# Altium schematic sheet Gleichrichter.SchDoc
size A4; SheetNumber: 1; SheetTotal: 1; SPICEModelCacheRRXWQSHM: <root> / <DocumentId>RRXWQSHM</DocumentId> / <CacheFrame Number="0"> / <Model Name="di_1n4001" Kind="MDL"> / <Text>*************************************************************************************************************************************** / *SRC=1N4001;DI_1N4001;Diodes;Si;  50.0V  1.00A  3.00us   Diodes, Inc. diode / .MODEL DI_1N4001 D  ( IS=76.9p RS=42.0m BV=50.0 IBV=5.00u / + CJO=39.8p  M=0.333 N=1.45 TT=4.32u )</Text> / </Model> / </CacheFrame> / </root>
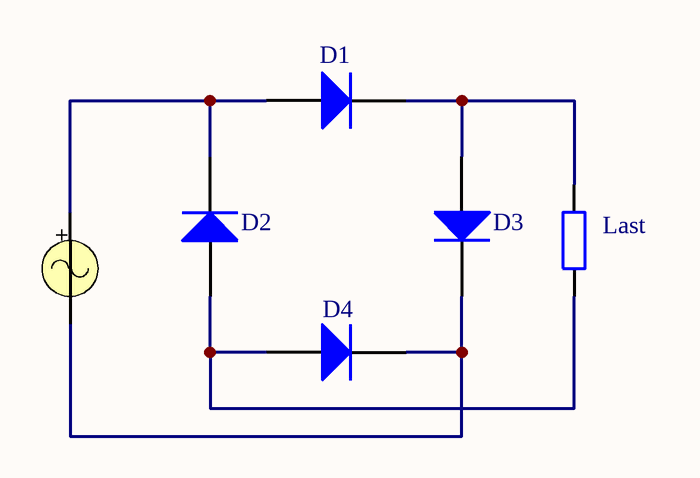
[diagram p0: Gleichrichter.SchDoc]

## Parts
D1  1N4001  [D_DO41-RM4]  (value not drawn)
D2  1N4001  [D_DO41-RM4]  (value not drawn)
D3  1N4001  [D_DO41-RM4]  (value not drawn)
D4  1N4001  [D_DO41-RM4]  (value not drawn)
Last  1K  [R_0207/RM4]  (value not drawn)
V?  SIN(0 1 1K 0 0 0)  (value not drawn)

## Nets
NetD1_A: D1.A D2.C(K) V?.1
NetD1_C: D1.C(K) D3.A Last.2
NetD2_A: D2.A D4.A Last.1
NetD3_C: D3.C(K) D4.C(K) V?.2

## Library data of the parts
D1-D4 = 1N4001: Si-Diode; 50V, 1.00A, 3.00us (Diodes, Inc.); Usage: only permitted for non-commercial purposes at HTL I Innsbruck; SimulationModellSource: Diodes Incorporated; Published: 21-Feb-2011; LatestRevisionDate: 01-Nov-2012
Last = R: Resistor; Usage: only permitted for non-commercial purposes at HTL I Innsbruck; Published: 21-Feb-2011; LatestRevisionDate: 07-Sep-2019; Value: 1K
V? = VSIN: Sinusoidal Voltage Source; AC Phase: 0; Amplitude: 1; AC Magnitude: 1; Damping Factor: 0; DC Magnitude: 0; Delay: 0; Frequency: 1K; Offset: 0; Phase: 0